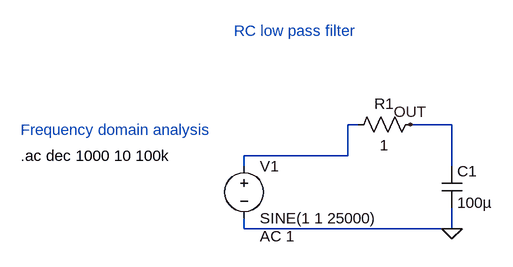
[diagram p0: schematic RC-lowpass- frequency-domain.asc]
RC-lowpass- frequency-domain.asc, the LTspice schematic file:
Version 4.1
SHEET 1 880 680
WIRE 400 176 400 192
WIRE 80 192 80 208
WIRE 400 192 400 208
WIRE 400 208 80 208
FLAG 400 208 0
WIRE 256 48 240 48
WIRE 80 112 80 96
WIRE 240 48 240 96
WIRE 240 96 80 96
WIRE 400 112 400 96
WIRE 336 48 352 48
WIRE 400 96 400 48
WIRE 400 48 352 48
FLAG 336 48 OUT
SYMBOL voltage 80 96 R0
WINDOW 123 24 124 Left 2
WINDOW 39 0 0 Left 2
SYMATTR Value2 AC 1
SYMATTR InstName V1
SYMATTR Value SINE(1 1 25000)
SYMBOL res 352 32 R90
WINDOW 0 0 56 VBottom 2
WINDOW 3 32 56 VTop 2
SYMATTR InstName R1
SYMATTR Value 1
SYMBOL cap 384 112 R0
SYMATTR InstName C1
SYMATTR Value 100µ
TEXT -264 96 Left 2 !.ac dec 1000 10 100k
TEXT 64 -96 Left 2 ;RC low pass filter
TEXT -264 56 Left 2 ;Frequency domain analysis

The netlist it stands for:
* RC-lowpass- frequency-domain.asc
V1 N001 0 SINE(1 1 25000) AC 1
R1 OUT N001 1
C1 OUT 0 100µ
.ac dec 1000 10 100k
* RC low pass filter
* Frequency domain analysis
.backanno
.end